# Altium schematic sheet Sheet1.SchDoc
size A4
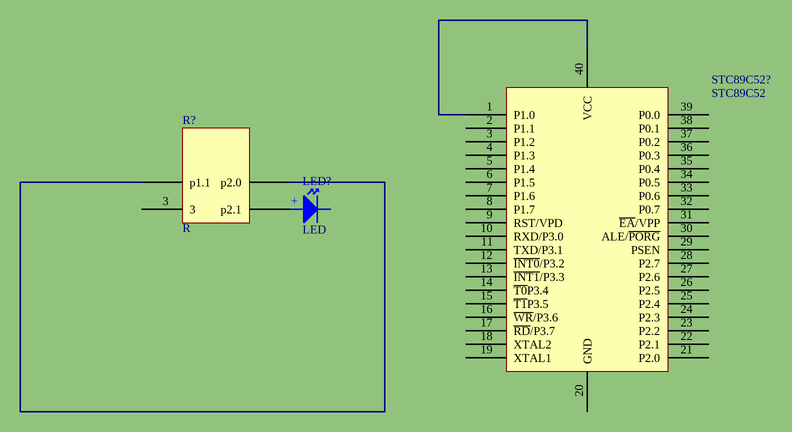
[diagram p0: Sheet1.SchDoc]

## Parts
LED?  LED
R?  R
STC89C52?  STC89C52

## Nets
NetLED?_+: LED?.+ R?.?1(p2.1)
NetR?_2: R?.2(p1.1) R?.p2.0
NetSTC89C52?_1: STC89C52?.1(P1.0) STC89C52?.40(VCC)

Not connected (* = marked no-connect by the designer): LED? -; R? 3; STC89C52? 2(P1.1) 3(P1.2) 4(P1.3) 5(P1.4) 6(P1.5) 7(P1.6) 8(P1.7) 9(RST/VPD) 10(RXD/P3.0) 11(TXD/P3.1) 12(~{INT0}/P3.2) 13(~{INT1}/P3.3) 14(~{T0}P3.4) 15(~{T1}P3.5) 16(~{WR}/P3.6) 17(~{RD}/P3.7) 18(XTAL2) 19(XTAL1) 20(GND) 21(P2.0) 22(P2.1) 23(P2.2) 24(P2.3) 25(P2.4) 26(P2.5) 27(P2.6) 28(P2.7) 29(PSEN) 30(ALE/~{PORG}) 31(~{EA}/VPP) 32(P0.7) 33(P0.6) 34(P0.5) 35(P0.4) 36(P0.3) 37(P0.2) 38(P0.1) 39(P0.0)